# Altium schematic sheet ESP32_Wroom_32UE.SchDoc
size A4; SheetNumber: 2; SheetTotal: 2
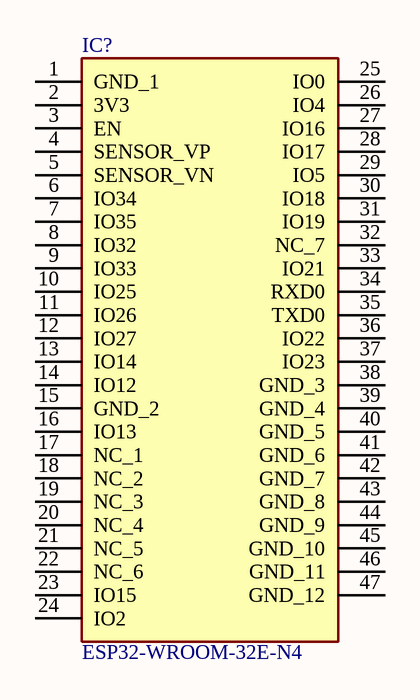
[diagram p0: ESP32_Wroom_32UE.SchDoc]

## Parts
IC?  ESP32-WROOM-32E-N4  [ESP32WROOM32EN4]

## Nets

Not connected (* = marked no-connect by the designer): IC? 1(GND_1) 2(3V3) 3(EN) 4(SENSOR_VP) 5(SENSOR_VN) 6(IO34) 7(IO35) 8(IO32) 9(IO33) 10(IO25) 11(IO26) 12(IO27) 13(IO14) 14(IO12) 15(GND_2) 16(IO13) 17(NC_1) 18(NC_2) 19(NC_3) 20(NC_4) 21(NC_5) 22(NC_6) 23(IO15) 24(IO2) 25(IO0) 26(IO4) 27(IO16) 28(IO17) 29(IO5) 30(IO18) 31(IO19) 32(NC_7) 33(IO21) 34(RXD0) 35(TXD0) 36(IO22) 37(IO23) 38(GND_3) 39(GND_4) 40(GND_5) 41(GND_6) 42(GND_7) 43(GND_8) 44(GND_9) 45(GND_10) 46(GND_11) 47(GND_12)

## Library data of the parts
IC? = ESP32-WROOM-32E-N4: Integrated Circuit; Manufacturer_Name: Espressif Systems; Datasheet Link: https://www.espressif.com/sites/default/files/documentation/esp32-wroom-32e_esp32-wroom-32ue_datasheet_en.pdf; Height: 3.25mm; Manufacturer_Part_Number: ESP32-WROOM-32E-N4; Mouser Part Number: 356-ESP32WRM32E132PH; Mouser Price/Stock: https://www.mouser.co.uk/ProductDetail/Espressif-Systems/ESP32-WROOM-32E-N4?qs=Li%252BoUPsLEnsPzTWsi%252BRMgQ%3D%3D